# Altium schematic sheet ICM40609.SchDoc
size A; SheetNumber: 6; SheetTotal: 14
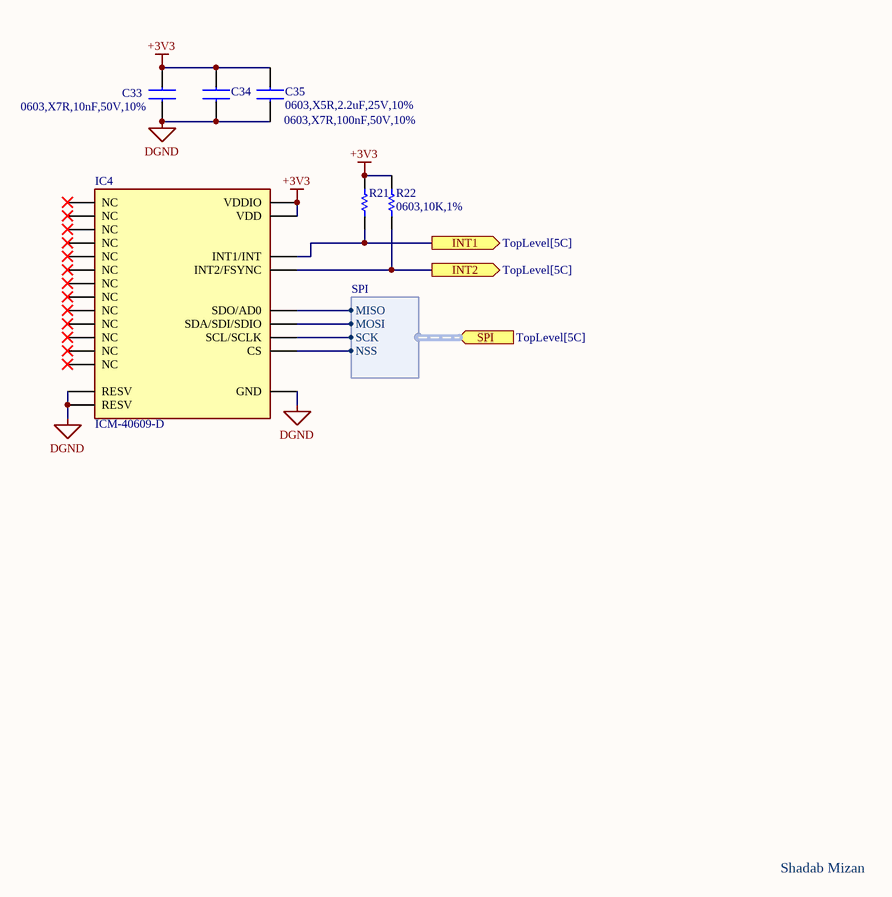
[diagram p0: ICM40609.SchDoc]

## Parts
C33  0603,X7R,10nF,50V,10%  [CAPC1608X90N]
C34  0603,X7R,100nF,50V,10%  [CAPC1608X90N]
C35  0603,X5R,2.2uF,25V,10%  [CAPC1608X90N]
IC4  ICM-40609-D  [LGA-24_L3.0-W3.0-P0.40-TL]
R21  0603,10K,1%  [RESC1608X90N]  (value not drawn)
R22  0603,10K,1%  [RESC1608X90N]

## Ports
INT1 (out, see TopLevel[5C]), INT2 (out, see TopLevel[5C]), SPI (in, harness SPI, see TopLevel[5C])

## Harnesses
SPI: NSS, SCK, MISO, MOSI

## Nets
+3V3: C33.2 C34.2 C35.2 IC4.8(VDDIO) IC4.13(VDD) R21.2 R22.2
DGND: C33.1 C34.1 C35.1 IC4.11(RESV) IC4.18(GND) IC4.20(RESV)
INT1: IC4.12(INT1/INT) R21.1 ; port INT1
INT2: IC4.19(INT2/FSYNC) R22.1 ; port INT2
NetIC4_9: IC4.9(SDO/AD0) ; port SPI.MISO
NetIC4_22: IC4.22(CS) ; port SPI.NSS
NetIC4_23: IC4.23(SCL/SCLK) ; port SPI.SCK
NetIC4_24: IC4.24(SDA/SDI/SDIO) ; port SPI.MOSI

Not connected (* = marked no-connect by the designer): IC4 1(NC)* 2(NC)* 3(NC)* 4(NC)* 5(NC)* 6(NC)* 7(NC)* 10(NC)* 14(NC)* 15(NC)* 16(NC)* 17(NC)* 21(NC)*

## Notes on the sheet
- Shadab Mizan

## Library data of the parts
C33 = 0603B103K500NT: 10nF ±10% 50V Ceramic Capacitor X7R 0603; LCSC Part #: C57112; Manu Part #: 0603B103K500NT
C34 = CC0603KRX7R9BB104: 50V 100nF X7R ±10% 0603 Multilayer Ceramic Capacitors MLCC - SMD/SMT ROHS; LCSC Part #: C14663; Manu Part #: CC0603KRX7R9BB104
C35 = CL10A225KO8NNNC: 2.2 µF ±10% 25V Ceramic Capacitor X5R 0603 (1608 Metric); Manu Part #: CL10A225KO8NNNC; LCSC Part #: C23630
IC4 = ICM-40609-D: LGA24-3x3 IMUs (Inertial Measurement Units) RoHS; Manu Part #: ICM-40609-D; LCSC Part #: C5360621
R21 R22 = 0603WAF1002T5E: 100mW Thick Film Resistor 75V ±100ppm/℃ ±1% 10kΩ 0603 Chip Resistor - Surface Mount ROHS; LCSC Part #: C25804; Manu Part #: 0603WAF1002T5E